# EAGLE design Mateusz.Kost (EAGLE 9.6.2)
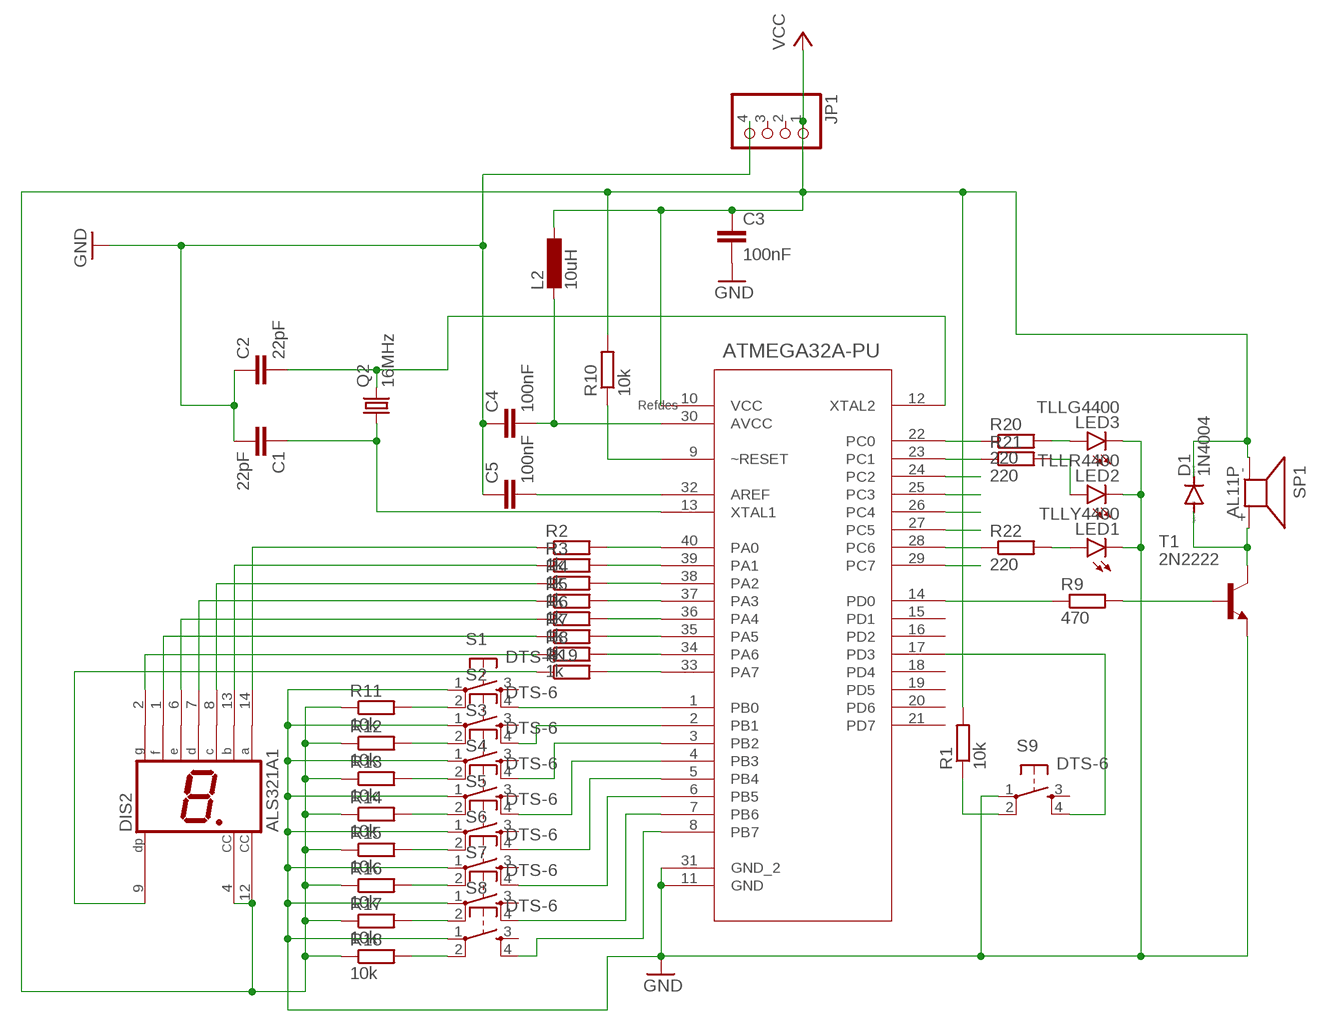
[diagram p0: schematic, sheet 1]

## Parts
C1  22pF  C2.5/2  [C2.5-2]
C2  22pF  C2.5/2  [C2.5-2]
C3  100nF  C2.5/2  [C2.5-2]
C4  100nF  C2.5/2  [C2.5-2]
C5  100nF  C2.5/2  [C2.5-2]
D1  1N4004  [DO41-10]
DIS2  ALS321A1  [ALS321A1]
JP1  PINHD-1X4  [1X04]
L2  10uH  L-EU0204/5  [0204/5]
LED1  TLLY4400  [LED3MM]
LED2  TLLR4400  [LED3MM]
LED3  TLLG4400  [LED3MM]
Q2  16MHz  CRYSTALHC49S  [HC49/S]
R1  10k  R-EU_0204/7  [0204/7]
R2  1k  R-EU_0204/7  [0204/7]
R3  1k  R-EU_0204/7  [0204/7]
R4  1k  R-EU_0204/7  [0204/7]
R5  1k  R-EU_0204/7  [0204/7]
R6  1k  R-EU_0204/7  [0204/7]
R7  1k  R-EU_0204/7  [0204/7]
R8  1k  R-EU_0204/7  [0204/7]
R9  470  R-EU_0204/7  [0204/7]
R10  10k  R-EU_0204/7  [0204/7]
R11  10k  R-EU_0204/7  [0204/7]
R12  10k  R-EU_0204/7  [0204/7]
R13  10k  R-EU_0204/7  [0204/7]
R14  10k  R-EU_0204/7  [0204/7]
R15  10k  R-EU_0204/7  [0204/7]
R16  10k  R-EU_0204/7  [0204/7]
R17  10k  R-EU_0204/7  [0204/7]
R18  10k  R-EU_0204/7  [0204/7]
R19  1k  R-EU_0204/7  [0204/7]
R20  220  R-EU_0204/7  [0204/7]
R21  220  R-EU_0204/7  [0204/7]
R22  220  R-EU_0204/7  [0204/7]
S1  DTS-6  [DTS-6]
S2  DTS-6  [DTS-6]
S3  DTS-6  [DTS-6]
S4  DTS-6  [DTS-6]
S5  DTS-6  [DTS-6]
S6  DTS-6  [DTS-6]
S7  DTS-6  [DTS-6]
S8  DTS-6  [DTS-6]
S9  DTS-6  [DTS-6]
SP1  AL11P  [AL11P]
T1  2N2222  [TO18]
U1  ATMEGA32A-PU  [DIP254P1524X482-40]

## Nets
GND: C1.2 C2.1 C3.2 C4.1 C5.1 JP1.4 LED1.K(C) LED2.K(C) LED3.K(C) S1.1 S2.1 S3.1 S4.1 S5.1 S6.1 S7.1 S8.1 S9.1 T1.1(E) U1.11(GND) U1.31(GND_2)
N$1: R9.1 U1.14(PD0)
N$2: R1.1 S9.2
N$3: R11.2 S1.2
N$4: S1.4 U1.1(PB0)
N$5: S2.4 U1.2(PB1)
N$6: S3.4 U1.3(PB2)
N$7: S4.4 U1.4(PB3)
N$8: S5.4 U1.5(PB4)
N$9: S6.4 U1.6(PB5)
N$10: R20.1 U1.22(PC0)
N$11: LED2.A R21.2
N$12: U1.24(PC2)
N$13: U1.25(PC3)
N$14: U1.26(PC4)
N$15: U1.27(PC5)
N$16: LED1.A R22.2
N$17: U1.29(PC7)
N$18: S7.4 U1.7(PB6)
N$19: R12.2 S2.2
N$20: R13.2 S3.2
N$21: R14.2 S4.2
N$22: R15.2 S5.2
N$23: R16.2 S6.2
N$24: R17.2 S7.2
N$25: R18.2 S8.2
N$27: C2.2 Q2.2 U1.12(XTAL2)
N$28: R9.2 T1.2(B)
N$29: S9.4 U1.17(PD3)
N$30: D1.A SP1.+ T1.3(C)
N$31: C4.2 L2.2 U1.30(AVCC)
N$32: C5.2 U1.32(AREF)
N$33: R10.1 U1.9(~RESET)
N$34: C1.1 Q2.1 U1.13(XTAL1)
N$35: R2.2 U1.40(PA0)
N$36: R3.2 U1.39(PA1)
N$37: R4.2 U1.38(PA2)
N$38: R5.2 U1.37(PA3)
N$39: R6.2 U1.36(PA4)
N$40: R7.2 U1.35(PA5)
N$41: R8.2 U1.34(PA6)
N$42: R19.2 U1.33(PA7)
N$43: DIS2.14(A) R2.1
N$45: DIS2.13(B) R3.1
N$46: DIS2.8(C) R4.1
N$47: DIS2.7(D) R5.1
N$48: DIS2.6(E) R6.1
N$49: DIS2.1(F) R7.1
N$50: DIS2.2(G) R8.1
N$51: DIS2.9(DP) R19.1
N$52: LED3.A R20.2
N$53: R21.1 U1.23(PC1)
N$54: R22.1 U1.28(PC6)
N$62: S8.4 U1.8(PB7)
VCC: C3.1 D1.C DIS2.4(CC) DIS2.12(CC) JP1.1 L2.1 R1.2 R10.2 R11.1 R12.1 R13.1 R14.1 R15.1 R16.1 R17.1 R18.1 SP1.- U1.10(VCC)
Unconnected: JP1.2 JP1.3 S1.3 S2.3 S3.3 S4.3 S5.3 S6.3 S7.3 S8.3 S9.3 U1.15(PD1) U1.16(PD2) U1.18(PD4) U1.19(PD5) U1.20(PD6) U1.21(PD7)

## Library data of the parts
C1-C5 = capacitor-wima:C: CAPACITOR naming: grid - package width
D1 = diode:1N4004: DIODE general purpose rectifier, 1 A
DIS2 = als321a1:ALS321A1: LED DISPLAY 1-character 7 segment, decimal point right
JP1 = pinhead:PINHD-1X4: PIN HEADER
L2 = rcl:L-EU: INDUCTOR, European symbol; SPICEPREFIX: L
LED1 = led:TLLY4400: Low Current (2mA) LED 3 mm Tinted Diffused Package color YELLOW Source: Data sheet <http://www.farnell.com/datasheets/391098.pdf>; MF: VISHAY SEMICONDUCTOR; OC_FARNELL: 1612439
LED2 = led:TLLR4400: Low Current (2mA) LED 3 mm Tinted Diffused Package color RED Source: Data sheet <http://www.farnell.com/datasheets/391100.pdf>; MF: VISHAY SEMICONDUCTOR; OC_FARNELL: 1612437
LED3 = led:TLLG4400: Low Current (2mA) LED 3 mm Tinted Diffused Package color GREEN Source: Data sheet <http://www.farnell.com/datasheets/391098.pdf>; MF: VISHAY SEMICONDUCTOR; OC_FARNELL: 1612435
Q2 = crystal:CRYSTAL: CRYSTAL; OC_FARNELL: 1667008; OC_NEWARK: unknown
R1-R22 = rcl:R-EU_: RESISTOR, European symbol; SPICEPREFIX: R
S1-S9 = switch-tact:DTS-6
SP1 = buzzer:AL11P: SPEAKER Source: Buerklin; OC_FARNELL: unknown; OC_NEWARK: unknown
T1 = transistor:2N2222: NPN TRANSISTOR
U1 = ATMEGA32A-PU:ATMEGA32A-PU: 8-bit Microcontrollerwith 32K Bytes In-System Programmable Flash Check prices <https://pricing.snapeda.com/parts/ATMEGA32A-PU/Microchip/view-part?ref=eda>; AVAILABILITY: Good; DESCRIPTION: AVR AVR® ATmega Microcontroller IC 8-Bit 16MHz 32KB (16K x 16) FLASH 40-PDIP; MF: Microchip; MP: ATMEGA32A-PU; PACKAGE: PDIP-40 Microchip; PRICE: None; PURCHASE-URL: https://pricing.snapeda.com/search/part/ATMEGA32A-PU/?ref=eda

## Board
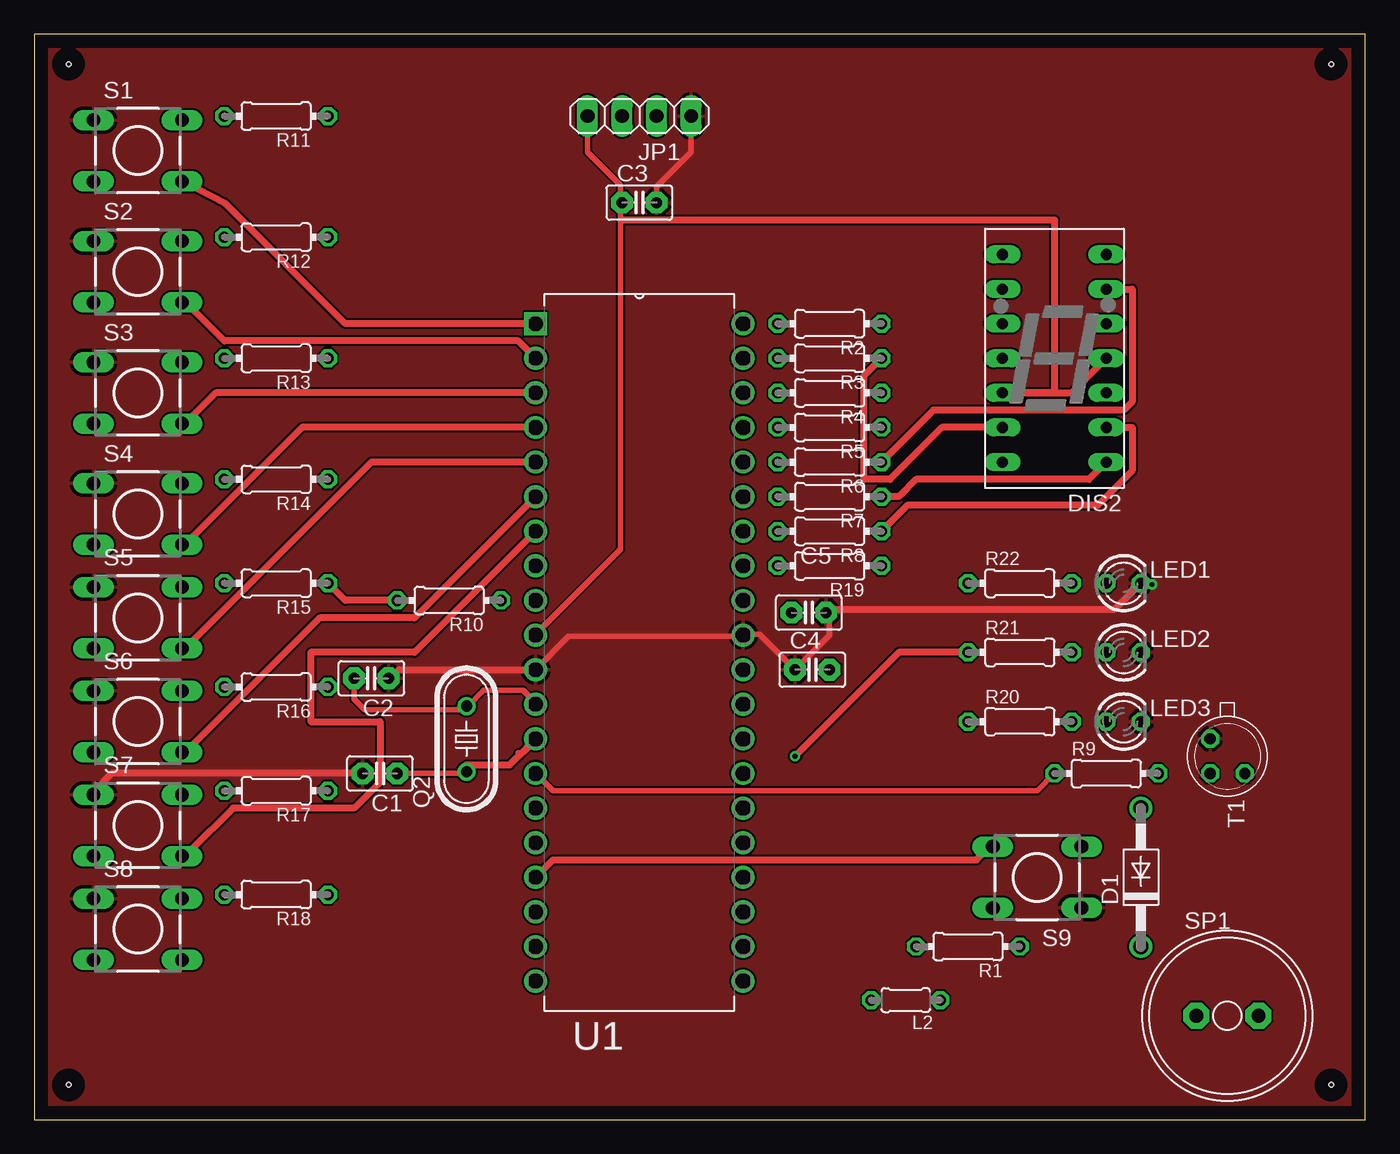
[diagram p1: board, top side]
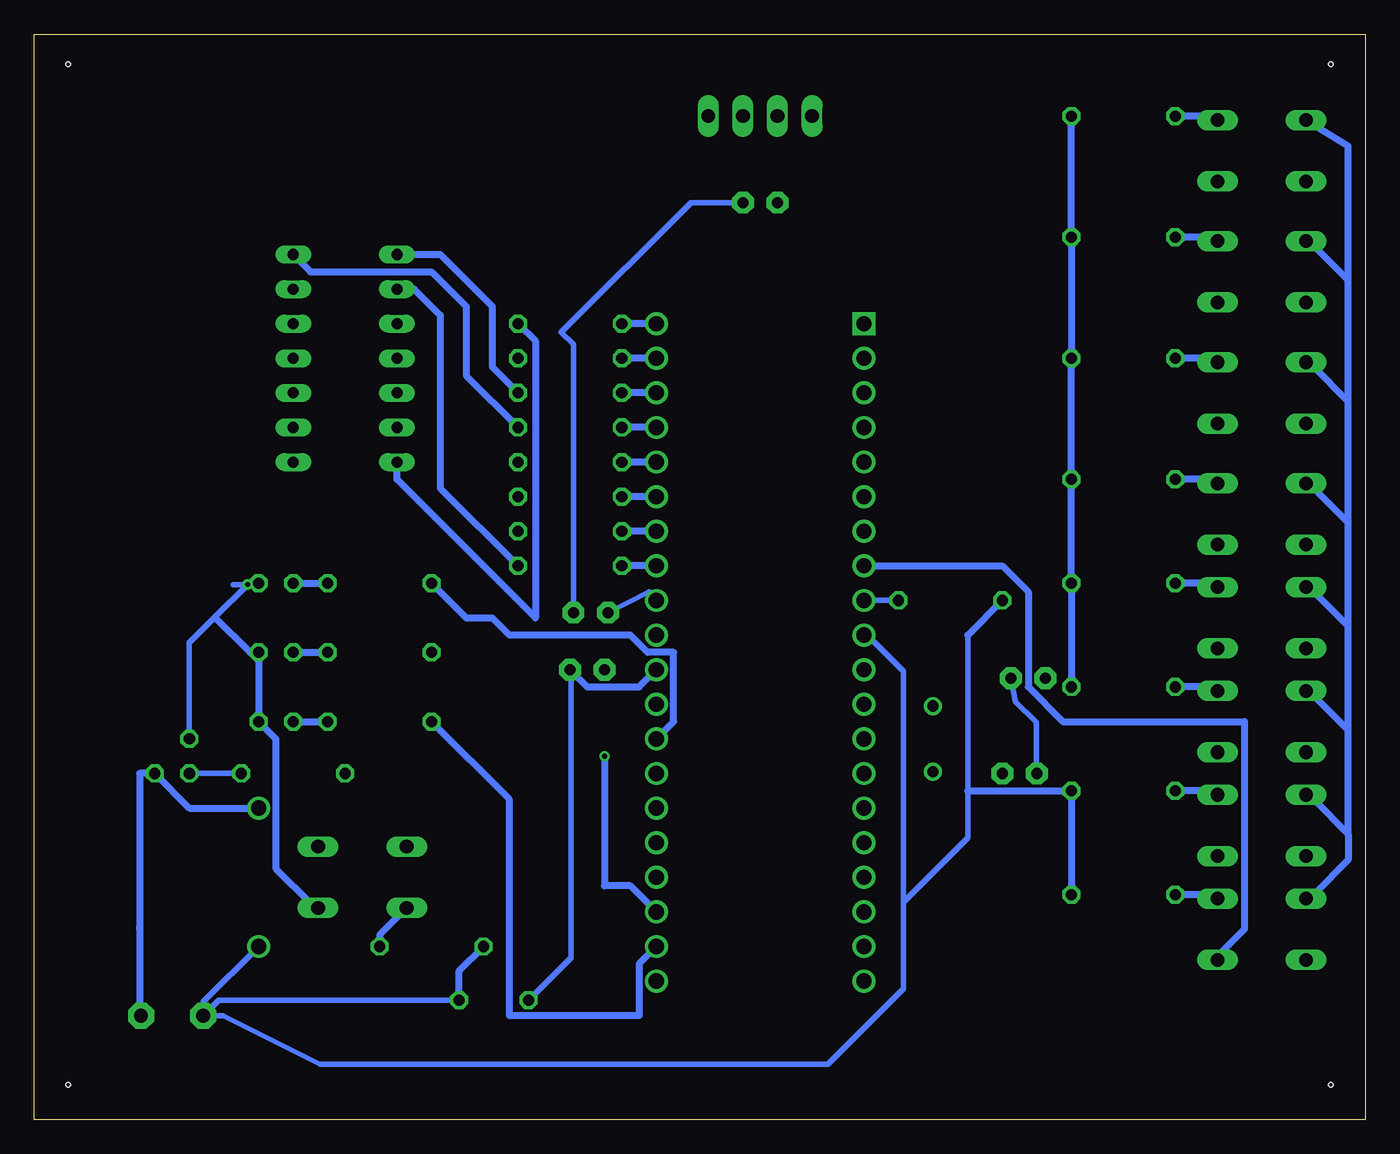
[diagram p2: board, bottom side, seen from below]

Size 97.77 x 79.68 mm. Coordinates in mm from the lower left corner, seen from the top.
Outline: 0,0 97.77,0 97.77,79.68 0,79.68 0,0
Copper layers (1*16): Top 0.035mm / dielectric 1.5mm / Bottom 0.035mm
Design rules "default": minimum track width 6mil, minimum drill 0.35mm, track to track 6mil, track to pad 6mil, pad to pad 6mil, via to via 6mil, smd to smd 6mil, copper to edge 40mil, drill to drill 6mil, minimum pad ring 10mil, minimum via ring 8mil, stop-mask expansion 4mil, vias tented up to drill 0mil, thermal gap 10mil
Holes 0.35 mm at 2.54,77.47 2.54,2.54 95.25,77.47 95.25,2.54

### Footprints (pad centres in the part's own frame; a part is rotated, then mirrored left to right if it is on the bottom)
C2.5-2 = drill 0.813 pad 1.6 octagon: 1 -1.27,0; 2 1.27,0
DO41-10 = drill 1.118: A 5.08,0; C -5.08,0
ALS321A1 = drill 0.813 long: 1 -3.81,7.62; 2 -3.81,5.08; 3 -3.81,2.54; 4 -3.81,0; 5 -3.81,-2.54; 6 -3.81,-5.08; 7 -3.81,-7.62; 8 3.81,-7.62; 9 3.81,-5.08; 10 3.81,-2.54; 11 3.81,0; 12 3.81,2.54; 13 3.81,5.08; 14 3.81,7.62
1X04 = drill 1.016 long: 1 -3.81,0; 2 -1.27,0; 3 1.27,0; 4 3.81,0
0204/5 = drill 0.813 octagon: 1 -2.54,0; 2 2.54,0
LED3MM = drill 0.813 octagon: A -1.27,0; K 1.27,0
HC49/S = drill 0.813: 1 -2.413,0; 2 2.413,0
0204/7 = drill 0.813 octagon: 1 -3.81,0; 2 3.81,0
DTS-6 = drill 1 long: 1 -3.25,2.25; 2 3.25,2.25; 3 -3.25,-2.25; 4 3.25,-2.25
AL11P = drill 1.016 pad 1.905 octagon: + 2.286,0; - -2.286,0
TO18 = drill 0.813 octagon: 1 -1.27,-1.27; 2 1.27,-1.27; 3 1.27,1.27
DIP254P1524X482-40 = drill 1.118 square: 1 -15.24,48.26 | drill 1.118: 2 -15.24,45.72; 3 -15.24,43.18; 4 -15.24,40.64; 5 -15.24,38.1; 6 -15.24,35.56; 7 -15.24,33.02; 8 -15.24,30.48; 9 -15.24,27.94; 10 -15.24,25.4; 11 -15.24,22.86; 12 -15.24,20.32; 13 -15.24,17.78; 14 -15.24,15.24; 15 -15.24,12.7; 16 -15.24,10.16; 17 -15.24,7.62; 18 -15.24,5.08; 19 -15.24,2.54; 20 -15.24,0; 21 0,0; 22 0,2.54; 23 0,5.08; 24 0,7.62; 25 0,10.16; 26 0,12.7; 27 0,15.24; 28 0,17.78; 29 0,20.32; 30 0,22.86; 31 0,25.4; 32 0,27.94; 33 0,30.48; 34 0,33.02; 35 0,35.56; 36 0,38.1; 37 0,40.64; 38 0,43.18; 39 0,45.72; 40 0,48.26

### Placement (x,y rotation side)
C1  25.4,25.4 180 top
C2  24.77,32.38 180 top
C3  44.45,67.31 0 top
C4  57.15,33.02 0 top
C5  56.9,37.21 180 top
D1  81.28,17.78 90 top
DIS2  74.93,55.88 180 top
JP1  44.45,73.66 0 top
L2  64.01,8.76 180 top
LED1  80.01,39.37 0 top
LED2  80.01,34.29 0 top
LED3  80.01,29.21 0 top
Q2  31.75,27.94 90 top
R1  68.58,12.7 180 top
R2  58.42,58.42 180 top
R3  58.42,55.88 180 top
R4  58.42,53.34 180 top
R5  58.42,50.8 180 top
R6  58.42,48.26 180 top
R7  58.42,45.72 180 top
R8  58.42,43.18 180 top
R9  78.74,25.4 0 top
R10  30.48,38.1 180 top
R11  17.78,73.66 180 top
R12  17.78,64.77 180 top
R13  17.78,55.88 180 top
R14  17.78,46.99 180 top
R15  17.78,39.37 180 top
R16  17.78,31.75 180 top
R17  17.78,24.13 180 top
R18  17.78,16.51 180 top
R19  58.42,40.64 180 top
R20  72.39,29.21 0 top
R21  72.39,34.29 0 top
R22  72.39,39.37 0 top
S1  7.62,71.12 0 top
S2  7.62,62.23 0 top
S3  7.62,53.34 0 top
S4  7.62,44.45 0 top
S5  7.62,36.83 0 top
S6  7.62,29.21 0 top
S7  7.62,21.59 0 top
S8  7.62,13.97 0 top
S9  73.66,17.78 180 top
SP1  87.63,7.62 0 top
T1  87.63,26.67 270 top
U1  52.07,10.16 0 top

### Tracks (layer width: path | path; a pad name or v marks a point on that pad's centre or on a via)
GND  (via drill 0.35)
  Top 0.152: LED1.K 81.92,39.37 v82.09,39.27 | 58.42,37.46 C5.1 | 4.45,24.13 S7.1
  Top 0.406: JP1.4 48.26,71.02 45.72,68.48 C3.2 | C5.1 58.42,36.96 58.42,35.56 C4.1 53.29,35.61 52.07,35.61 U1.31 52.07,35.46 39.27,35.46 U1.11 | 26.77,33.02 26.16,32.41 C2.1
  Top 0.508: 26.77,33.02 U1.11 | LED1.K 79.38,37.46 58.42,37.46 | 4.45,24.13 5.71,25.4 C1.2
  Bottom 0.152: LED2.K 81.92,34.29
  Bottom 0.406: T1.1 86.36,35 84.49,36.87 v82.09,39.27 83.16,39.27 | C1.2 24.18,25.4 24.18,29.16 25.69,30.67 C2.1 | C3.2 49.53,67.31 59.05,57.79 58.17,56.9 C5.1
  Bottom 0.508: 1.27,20.95 1.27,19.05 3.81,16.51 S8.1 | 1.27,20.95 3.81,23.49 S7.1 | 1.27,28.58 3.81,31.12 S6.1 | 1.27,20.95 1.27,28.58 | 1.27,36.2 3.81,38.73 S5.1 | 1.27,28.58 1.27,36.2 | 1.27,43.82 3.81,46.35 S4.1 | 1.27,36.2 1.27,43.82 | 1.27,52.71 3.81,55.24 S3.1 | 1.27,43.82 1.27,52.71 | 1.27,61.6 3.81,64.13 S2.1 | 1.27,52.71 1.27,61.6 | 1.27,61.6 1.27,71.46 S1.1 | LED2.K LED3.K 80.01,27.94 80.01,18.41 77.47,15.88 S9.1 | 81.92,34.29 84.49,36.87
  pour Top: 0,80.01 97.79,80.01 97.79,0 0,0
N$1
  Top 0.406: U1.14 38.1,24.13 73.66,24.13 R9.1
N$2
  Bottom 0.508: S9.2 72.39,13.55 R1.1
N$3
  Bottom 0.508: R11.2 11.43,73.66 S1.2
N$4
  Top 0.508: U1.1 22.86,58.42 14.06,67.22 S1.4
N$5
  Top 0.508: U1.2 35.56,57.15 13.97,57.15 11.43,59.69 S2.4
N$6
  Top 0.508: U1.3 13.34,53.34 11.43,51.43 S3.4
N$7
  Top 0.508: U1.4 19.68,50.8 11.43,42.55 S4.4
N$8
  Top 0.508: U1.5 24.77,48.26 11.43,34.92 S5.4
N$9
  Top 0.508: U1.6 27.94,36.83 20.95,36.83 11.43,27.3 S6.4
N$10
  Bottom 0.406: 52.07,12.75 U1.22
  Bottom 0.508: R20.1 62.87,23.49 62.87,7.62 53.34,7.62 53.34,11.43 U1.22
N$11
  Bottom 0.508: LED2.A R21.2
N$16
  Bottom 0.508: LED1.A R22.2
N$18
  Top 0.508: U1.7 27.94,34.29 20.32,34.29 20.32,29.21 25.4,29.21 25.4,24.77 23.49,22.86 14.61,22.86 11.43,19.69 S7.4
N$19
  Bottom 0.508: R12.2 11.43,64.77 S2.2
N$20
  Bottom 0.508: R13.2 11.43,55.88 S3.2
N$21
  Bottom 0.508: R14.2 11.43,46.99 S4.2
N$22
  Bottom 0.508: R15.2 11.43,39.37 S5.2
N$23
  Bottom 0.508: R16.2 11.43,31.75 S6.2
N$24
  Bottom 0.508: R17.2 11.43,24.13 S7.2
N$25
  Bottom 0.508: R18.2 11.43,16.51 S8.2
N$27
  Top 0.406: U1.12 36.83,30.58 35.92,31.5 33.02,31.5 31.75,30.23 | C2.2 23.49,30.86 24.28,30.07 31.6,30.07 31.75,30.23 | 31.75,30.23 Q2.2
N$28
  Bottom 0.406: T1.2 R9.2
N$29
  Top 0.152: 69.85,19.69 S9.4
  Top 0.508: 69.85,19.69 69.22,19.05 38.1,19.05 U1.17
N$30
  Bottom 0.508: SP1.+ 90.02,7.67 90.02,13.97 90.02,14.12 90.02,25.4 T1.3 86.36,22.86 D1.A
N$31
  Bottom 0.305: C4.2 57.15,31.75
  Bottom 0.406: L2.2 58.34,11.89 58.34,32.94 C4.2
  Bottom 0.508: U1.30 53.34,31.75 57.15,31.75 C4.2
N$32
  Bottom 0.406: C5.2 52.59,38.73 52.07,38.2 U1.32
N$33
  Bottom 0.406: U1.9 R10.1
N$34
  Top 0.152: 36.2,27.3 36.25,27.25 | 31.75,26.03 Q2.1
  Top 0.406: C1.1 31.65,25.4 31.75,25.5 Q2.1 | 35.56,26.92 35.92,26.92 36.25,27.25 36.83,27.84 U1.13
  Top 0.508: 36.2,27.3 34.92,26.03 31.75,26.03
N$35
  Bottom 0.508: U1.40 R2.2
N$36
  Bottom 0.508: U1.39 R3.2
N$37
  Bottom 0.508: U1.38 R4.2
N$38
  Bottom 0.508: U1.37 R5.2
N$39
  Bottom 0.508: U1.36 R6.2
N$40
  Bottom 0.508: U1.35 R7.2
N$41
  Bottom 0.508: U1.34 R8.2
N$42
  Bottom 0.508: U1.33 R19.2
N$43
  Bottom 0.508: DIS2.14 71.12,46.99 60.96,36.83 60.96,57.15 R2.1
N$45
  Top 0.508: R3.1 60.96,54.61 60.96,46.99 62.87,46.99 66.68,50.8 DIS2.13
N$46
  Bottom 0.508: R4.1 64.14,55.24 64.14,59.69 67.95,63.5 DIS2.8
N$47
  Bottom 0.508: R5.1 66.04,54.61 66.04,59.69 68.58,62.23 77.47,62.23 DIS2.7
N$48
  Top 0.508: R6.1 66.04,52.07 80.01,52.07 80.65,52.71 80.65,60.96 DIS2.6
N$49
  Top 0.508: R7.1 63.5,45.72 64.77,46.99 77.47,46.99 DIS2.1
N$50
  Top 0.508: R8.1 64.14,45.09 78.11,45.09 80.65,47.62 80.65,50.8 DIS2.2
N$51
  Bottom 0.152: DIS2.9 69.85,60.96
  Bottom 0.508: R19.1 67.95,46.35 67.95,59.05 69.85,60.96
N$52
  Bottom 0.508: LED3.A R20.2
N$53  (via drill 0.35)
  Top 0.508: R21.1 63.5,34.29 v55.88,26.67
  Bottom 0.406: 52.07,15.34 U1.23
  Bottom 0.508: v55.88,26.67 55.88,17.15 53.98,17.15 U1.23
N$54
  Bottom 0.508: R22.1 66.04,36.83 64.14,36.83 62.87,35.56 53.98,35.56 52.7,34.29 50.8,34.29 50.8,29.21 U1.28
N$62
  Bottom 0.152: 10.8,12.06 S8.4
  Bottom 0.508: 10.8,12.06 8.89,13.97 8.89,29.21 22.22,29.21 24.77,31.75 24.77,38.73 26.67,40.64 U1.8
VCC
  Top 0.406: JP1.1 40.64,71.02 43.08,68.58 43.08,67.31 | 43.08,67.31 43.08,66.04 43.08,41.86 36.83,35.61 U1.10 | 43.08,67.31 C3.1
  Top 0.508: DIS2.4 76.2,53.34 DIS2.12 74.93,53.34 74.93,66.04 43.08,66.04 | R15.1 22.86,38.1 R10.2
  Bottom 0.406: SP1.- 83.87,7.62 76.76,4.06 39.47,4.06 33.93,9.6 33.93,15.95 | U1.10 36.58,35.56 33.93,32.92 33.93,15.95 | 33.93,15.95 29.21,20.68 29.21,24.13 29.21,35.56 | L2.1 84.2,8.76 SP1.- | D1.C 85.34,8.64 SP1.-
  Bottom 0.508: R10.2 29.21,35.56 | R11.1 R12.1 R13.1 R14.1 R15.1 R16.1 | R18.1 R17.1 29.21,24.13 | L2.1 66.55,10.92 R1.2